# EAGLE schematic SoundDetectorModule (EAGLE 7.7.0)
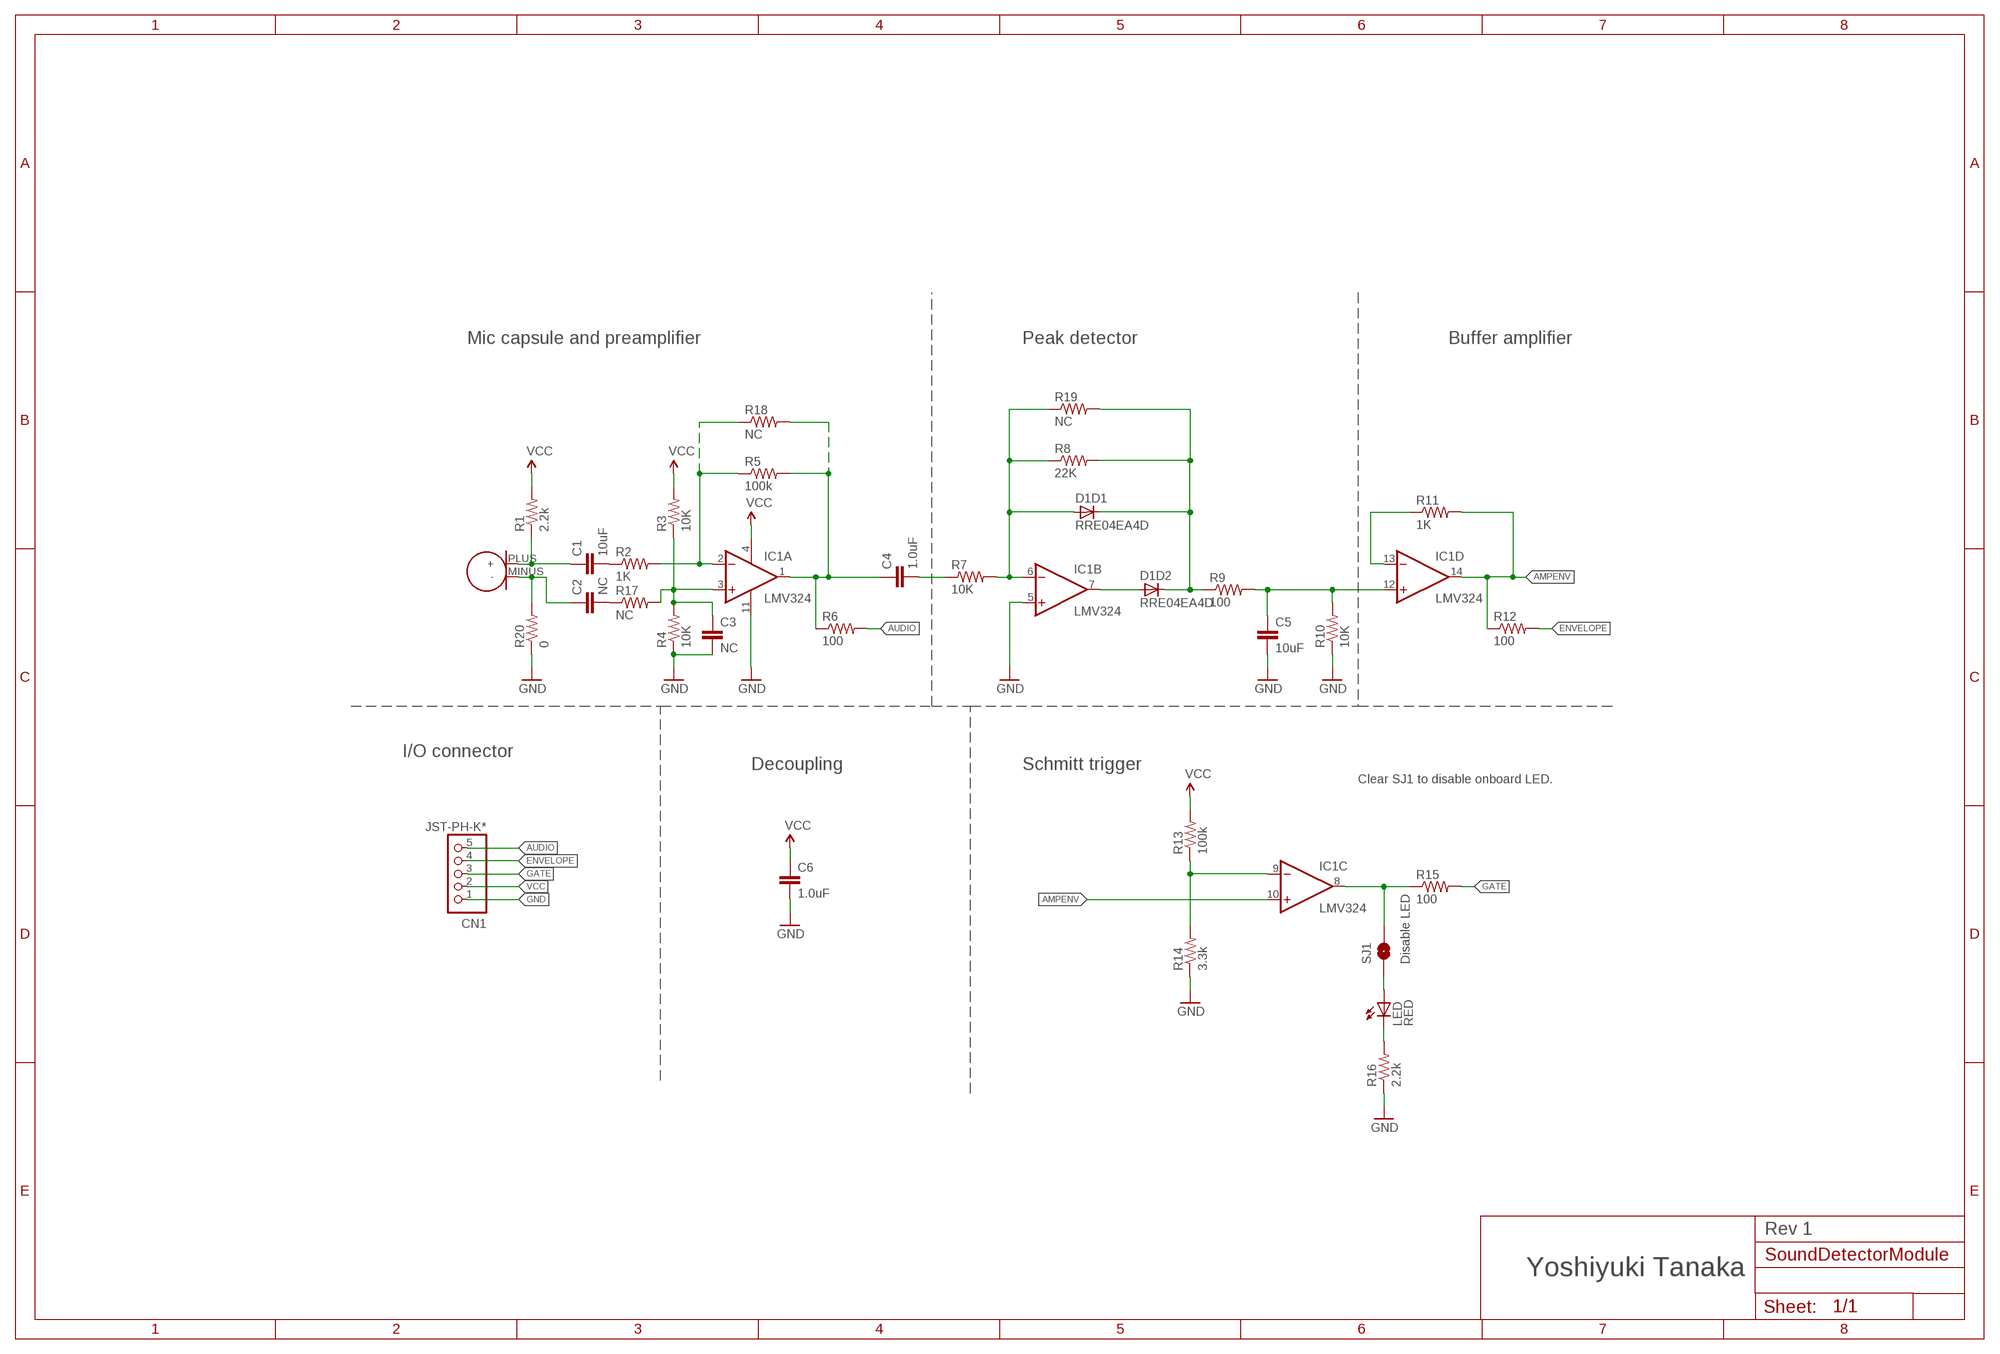
[diagram p0: schematic, sheet 1]

## Parts
A1  MO093803-3  [MO093803-3]
C1  10uF  C-EUC1206  [C1206]
C2  NC  C-EUC0603  [C0603]
C3  NC  C-EUC0603  [C0603]
C4  1.0uF  C-EUC0603  [C0603]
C5  10uF  C-EUC1206  [C1206]
C6  1.0uF  C-EUC0603  [C0603]
CN1  JST-PH-K*  B5B-PH-SM4-TB  [B5B-PH-SM4-TB]
D1  RRE04EA4D  [TSMD5]
IC1  LMV324  [SO14]
LED  RED  SML-E1X  [SML-E1X]
R1  2.2k  R-US_R0603  [R0603]
R2  1K  R-US_R0603  [R0603]
R3  10K  R-US_R0603  [R0603]
R4  10K  R-US_R0603  [R0603]
R5  100k  R-US_R0603  [R0603]
R6  100  R-US_R0603  [R0603]
R7  10K  R-US_R0603  [R0603]
R8  22K  R-US_R0603  [R0603]
R9  100  R-US_R0603  [R0603]
R10  10K  R-US_R0603  [R0603]
R11  1K  R-US_R0603  [R0603]
R12  100  R-US_R0603  [R0603]
R13  100k  R-US_R0603  [R0603]
R14  3.3k  R-US_R0603  [R0603]
R15  100  R-US_R0603  [R0603]
R16  2.2k  R-US_R0603  [R0603]
R17  NC  R-US_R0603  [R0603]
R18  NC  R-US_0207/7  [0207/7]
R19  NC  R-US_0207/7  [0207/7]
R20  0  R-US_R0603  [R0603]
SJ1  Disable LED  SOLDERJUMPERNC  [SJ_2S]

## Nets
AMPENV: IC1.10(C:+IN) IC1.14(D:OUT) R11.2 R12.1
AUDIO: CN1.5 R6.2
ENVELOPE: CN1.4 R12.2
GATE: CN1.3 R15.2
GND: C3.2 C5.2 C6.2 CN1.1 IC1.5(B:+IN) IC1.11(P:V-) R4.1 R10.1 R14.1 R16.1 R20.1
N$: C4.1 IC1.1(A:OUT) R5.2 R6.1 R18.2
N$1: A1.PLUS(+) C1.1 R1.1
N$2: C3.1 IC1.3(A:+IN) R3.1 R4.2 R17.2
N$3: LED.C R16.2
N$4: IC1.2(A:-IN) R2.2 R5.1 R18.1
N$5: C1.2 R2.1
N$6: C4.2 R7.1
N$7: D1.1(D1:A) IC1.6(B:-IN) R7.2 R8.1 R19.1
N$8: D1.3(D2:A) IC1.7(B:OUT)
N$9: D1.4(D2:C) D1.5(D1:C) R8.2 R9.1 R19.2
N$10: C5.1 IC1.12(D:+IN) R9.2 R10.2
N$11: IC1.13(D:-IN) R11.1
N$12: LED.A SJ1.1
N$13: C2.2 R17.1
N$14: A1.MINUS(-) C2.1 R20.2
N$15: IC1.9(C:-IN) R13.1 R14.2
N$16: IC1.8(C:OUT) R15.1 SJ1.2
VCC: C6.1 CN1.2 IC1.4(P:V+) R1.2 R3.2 R13.2

## Notes on the sheet
- Mic capsule and preamplifier | Peak detector | Buffer amplifier
- I/O connector
- Decoupling | Schmitt trigger
- Clear SJ1 to disable onboard LED.
- Rev 1
- Yoshiyuki Tanaka

## Library data of the parts
A1 = mouser:MO093803-3
C1-C6 = rcl:C-EU: CAPACITOR, European symbol
CN1 = jst-ph:B5B-PH-*: Wire-to-Board 2.0mm pitch top mount connector Source: http://www.jst-mfg.com/product/pdf/jpn/PH.pdf http://www.jst-mfg.com/product/detail.php?series=199
D1 = rohm2:RRE04EA4D
IC1 = ti:LMV324: Quad General Purpose, Low Voltage, Rail-to-Rail Output Operational Amplifiers Source: http://www.national.com/mpf/LM/LMV321.html http://www.national.com/dt/lmv_qual.pdf
LED = lazurite:SML-E1X
R1-R17 R20 = rcl:R-US_: RESISTOR, American symbol
R18 R19 = resistor:R-US_: RESISTOR, American symbol
SJ1 = SparkFun-Passives:SOLDERJUMPER: Solder Jumper Standard SMD solder jumper. Used to automate production. Two varients : Normally Open and Normally Closed are the same, but have different paste layers. NC will have a large amount of paste and should jumper during reflow.